# Altium schematic sheet MB1183_B.SchDoc
size A4; Revision: B.1
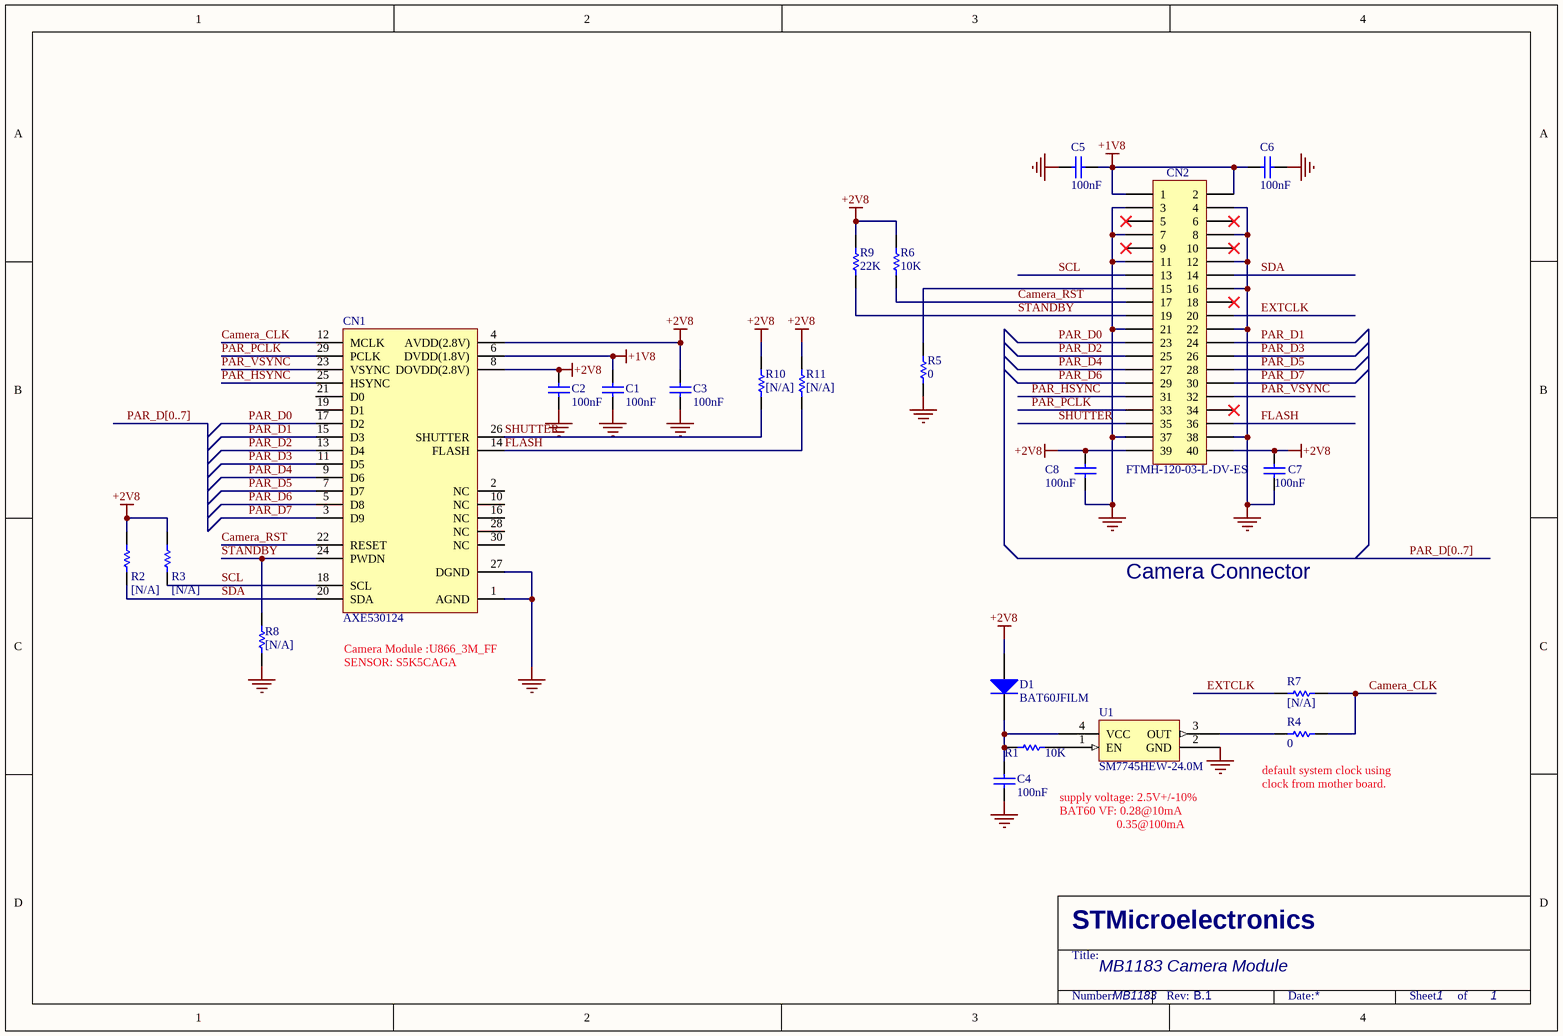
[diagram p0: MB1183_B.SchDoc]

## Parts
C1  100nF  [0603C]
C2  100nF  [0603C]
C3  100nF  [0603C]
C4  100nF  [0603C]
C5  100nF  [0603C]
C6  100nF  [0603C]
C7  100nF  [0603C]
C8  100nF  [0603C]
CN1  AXE530124  [AXE530124]
CN2  FTMH-120-03-L-DV-ES  [FTMH-120-03-L-DV-ES]
D1  BAT60JFILM  [SOD-323]
R1  10K  [0603R]
R2  [N/A]  [0603R]
R3  [N/A]  [0603R]
R4  0  [0603R]
R5  0  [0603R]
R6  10K  [0603R]
R7  [N/A]  [0603R]
R8  [N/A]  [0603R]
R9  22K  [0603R]
R10  [N/A]  [0603R]
R11  [N/A]  [0603R]
U1  SM7745HEW-24.0M  [XTAL_5X7]

## Nets
+1V8: C1.1 C5.2 C6.1 CN1.6(DVDD(1.8V)) CN2.1 CN2.2
+2V8: C2.1 C3.1 C7.1 C8.1 CN1.4(AVDD(2.8V)) CN1.8(DOVDD(2.8V)) CN2.39 CN2.40 D1.1(A) R2.1 R3.1 R6.1 R9.1 R10.1 R11.1
GND: C1.2 C2.2 C3.2 C4.2 C5.1 C6.2 C7.2 C8.2 CN1.1(AGND) CN1.27(DGND) CN2.3 CN2.4 CN2.7 CN2.8 CN2.11 CN2.12 CN2.16 CN2.21 CN2.22 CN2.37 CN2.38 R5.2 R8.1 U1.2(GND)
Camera_CLK: CN1.12(MCLK) R4.2 R7.2
Camera_RST: CN1.22(RESET) CN2.17 R6.2
EXTCLK: CN2.20 R7.1
FLASH: CN1.14(FLASH) CN2.36 R11.2
PAR_D0: CN1.17(D2) CN2.23
PAR_D1: CN1.15(D3) CN2.24
PAR_D2: CN1.13(D4) CN2.25
PAR_D3: CN1.11(D5) CN2.26
PAR_D4: CN1.9(D6) CN2.27
PAR_D5: CN1.7(D7) CN2.28
PAR_D6: CN1.5(D8) CN2.29
PAR_D7: CN1.3(D9) CN2.30
PAR_HSYNC: CN1.25(HSYNC) CN2.31
PAR_PCLK: CN1.29(PCLK) CN2.33
PAR_VSYNC: CN1.23(VSYNC) CN2.32
SCL: CN1.18(SCL) CN2.13 R3.2
SDA: CN1.20(SDA) CN2.14 R2.2
SHUTTER: CN1.26(SHUTTER) CN2.35 R10.2
STANDBY: CN1.24(PWDN) CN2.19 R8.2 R9.2
NetC4_1: C4.1 D1.2(K) R1.1 U1.4(VCC)
NetCN2_15: CN2.15 R5.1
NetR1_2: R1.2 U1.1(EN)
NetR4_1: R4.1 U1.3(OUT)

Not connected (* = marked no-connect by the designer): CN1 2(NC) 10(NC) 16(NC) 19(D1) 21(D0) 28(NC) 30(NC); CN2 5* 6* 9* 10* 18* 34*

## Buses and harness runs
bus PAR_D[0..7]

## Notes on the sheet
- Camera Connector
- (near CN1) Camera Module :U866_3M_FF
  SENSOR: S5K5CAGA
- supply voltage: 2.5V+/-10%
  BAT60 VF: 0.28@10mA
  0.35@100mA
- (near R4) default system clock using clock from mother board.
- MB1183 Camera Module
- MB1183
- 1
- STMicroelectronics
- Title:
- Number:
- Rev:
- Date:
- Sheet       of

## Library data of the parts
C1-C8 = Cap: Capacitor; Value: 10nF; Published: 8-Jun-2000; Revision: July-2002: Re-released for DXP Platform.; Publisher: Altium Limited
CN1 = U866_3M_FF: CAMERA MODULE
CN2 = Header 20X2: 20*2Pins, 1mm_SMT, male; Revision: 17-Jul-2002: Re-released for DXP Platform.; Publisher: Altium Limited
D1 = Diode: Default Diode; Code - JEDEC: DO-214-AB; Published: 8-Jun-2000; Revision: July-2002: Re-released for DXP Platform.; Publisher: Altium Limited
R1 R3 R5-R11 = Res1: Resistor; Value: 1K; Published: 8-Jun-2000; Revision: July-2002: Re-released for DXP Platform.; Publisher: Altium Limited
R2 = Res1: Resistor 10K; Value: 1K; Published: 8-Jun-2000; Revision: July-2002: Re-released for DXP Platform.; Publisher: Altium Limited
R4 = Res1: Resistor; Published: 8-Jun-2000; Revision: July-2002: Re-released for DXP Platform.; Publisher: Altium Limited; Value: 0
U1 = SM7745HEV-50.0M